# Altium schematic sheet Fuse Block.SchDoc
size A4
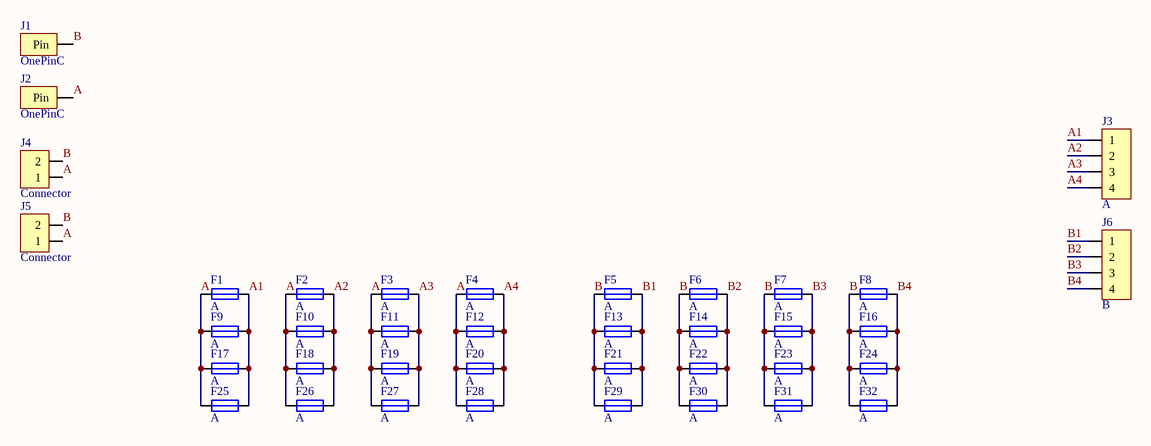
[diagram p0: Fuse Block.SchDoc]

## Parts
F1  A  [Fuse 9p]
F2  A  [Fuse 9p]
F3  A  [Fuse 9p]
F4  A  [Fuse 9p]
F5  A  [Fuse 9p]
F6  A  [Fuse 9p]
F7  A  [Fuse 9p]
F8  A  [Fuse 9p]
F9  A  [Fuse Car F 10A]
F10  A  [Fuse Car F 10A]
F11  A  [Fuse Car F 10A]
F12  A  [Fuse Car F 10A]
F13  A  [Fuse Car F 10A]
F14  A  [Fuse Car F 10A]
F15  A  [Fuse Car F 10A]
F16  A  [Fuse Car F 10A]
F17  A  [Fuse Car Mini]
F18  A  [Fuse Car Mini]
F19  A  [Fuse Car Mini]
F20  A  [Fuse Car Mini]
F21  A  [Fuse Car Mini]
F22  A  [Fuse Car Mini]
F23  A  [Fuse Car Mini]
F24  A  [Fuse Car Mini]
F25  A  [Fuse 5x20 Open holder]
F26  A  [Fuse 5x20 Open holder]
F27  A  [Fuse 5x20 Open holder]
F28  A  [Fuse 5x20 Open holder]
F29  A  [Fuse 5x20 Open holder]
F30  A  [Fuse 5x20 Open holder]
F31  A  [Fuse 5x20 Open holder]
F32  A  [Fuse 5x20 Open holder]
J1  OnePinC  [OnePin 1.5x4]
J2  OnePinC  [OnePin 1.5x4]
J3  A  [TBC 7.62 - 4]
J4  Connector  [DG301 5mm 2p]
J5  Connector  [TBC 7.62 - 2]
J6  B  [TBC 7.62 - 4]

## Nets
A: F1.1 F2.1 F3.1 F4.1 F9.1 F10.1 F11.1 F12.1 F17.1 F18.1 F19.1 F20.1 F25.1 F26.1 F27.1 F28.1 J2.1(Pin) J4.1 J5.1
A1: F1.2 F9.2 F17.2 F25.2 J3.1
A2: F2.2 F10.2 F18.2 F26.2 J3.2
A3: F3.2 F11.2 F19.2 F27.2 J3.3
A4: F4.2 F12.2 F20.2 F28.2 J3.4
B: F5.1 F6.1 F7.1 F8.1 F13.1 F14.1 F15.1 F16.1 F21.1 F22.1 F23.1 F24.1 F29.1 F30.1 F31.1 F32.1 J1.1(Pin) J4.2 J5.2
B1: F5.2 F13.2 F21.2 F29.2 J6.1
B2: F6.2 F14.2 F22.2 F30.2 J6.2
B3: F7.2 F15.2 F23.2 F31.2 J6.3
B4: F8.2 F16.2 F24.2 F32.2 J6.4

## Library data of the parts
F1-F32 = Fuse: Round fuse
J1 J2 = OnePin Connector: Only pad
J3 J6 = TBC - 7.62 - 4: Terminal Block 7.62
J4 = DG301-5.0-2P12: DG301 series
J5 = TBC - 7.62 - 2: Terminal Block 7.62